# Altium schematic sheet RF19_Sensor_CAN_Module_MCU.SchDoc
size A4; Author: Tal Zaitsev; CompanyName: Ryerson Formula Racing; Engineer: Tal Zaitsev; DocumentNumber: 1; Revision: 00A; SheetNumber: 1; SheetTotal: 3
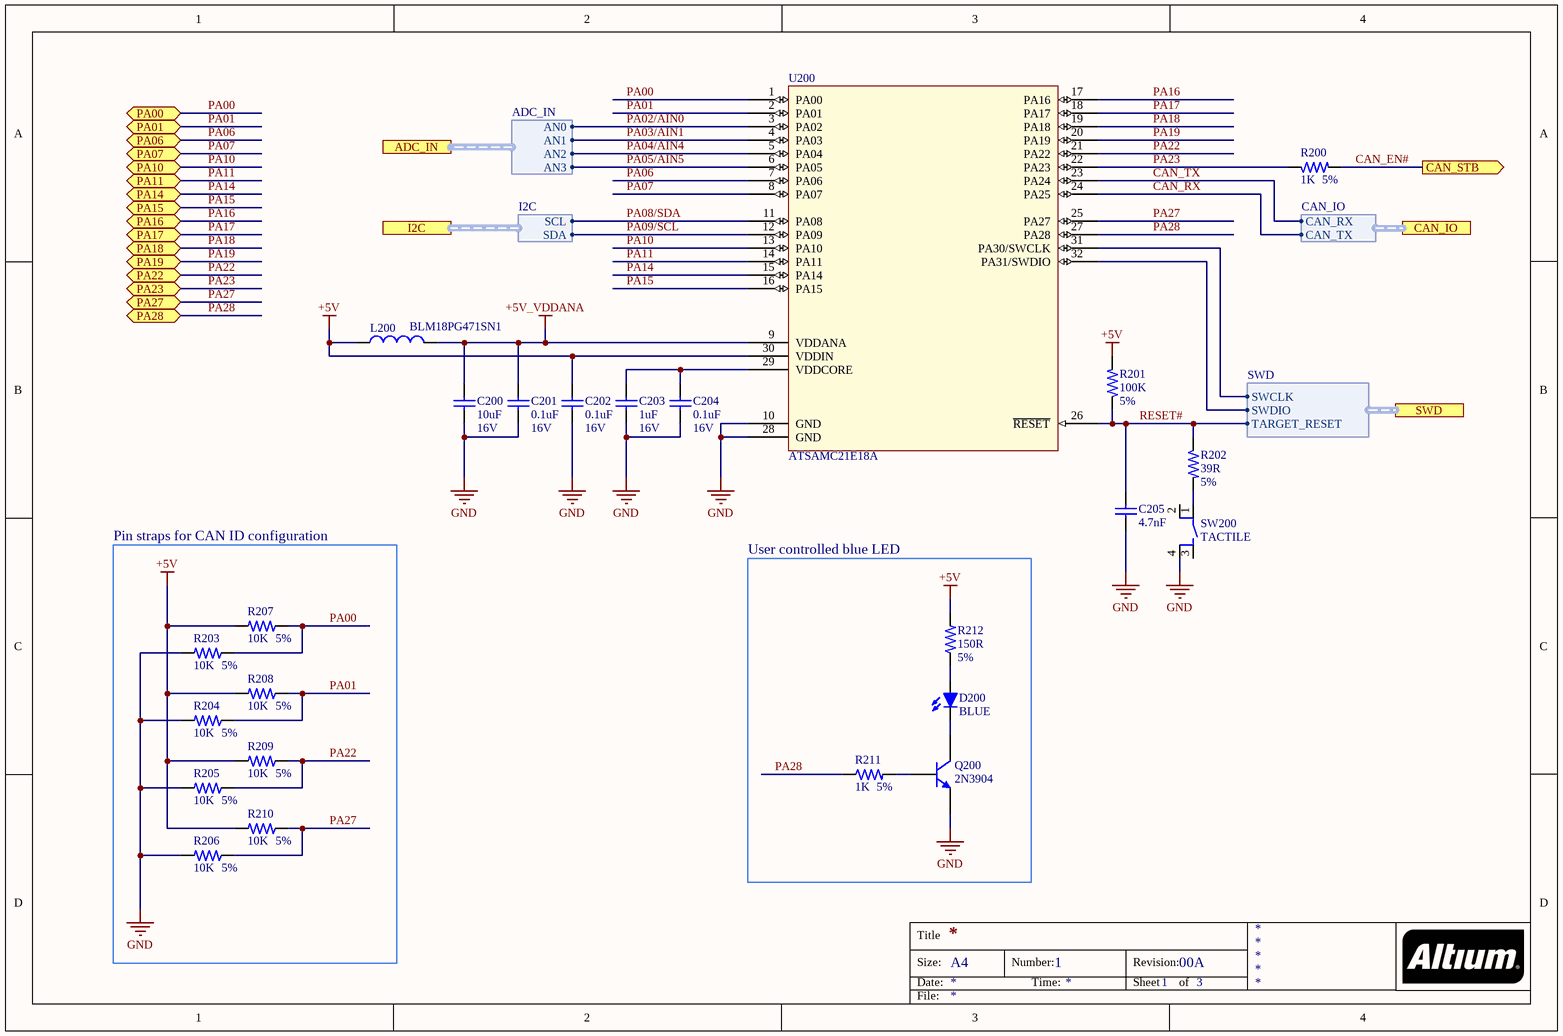
[diagram p0: RF19_Sensor_CAN_Module_MCU.SchDoc]

## Parts
C200  value 10uF  Voltage: 16V  [C0603]  (hidden comment: CERAMIC CAP)
C201  value 0.1uF  Voltage: 16V  [C0402]  (hidden comment: CERAMIC CAP)
C202  value 0.1uF  Voltage: 16V  [C0402]  (hidden comment: CERAMIC CAP)
C203  value 1uF  Voltage: 16V  [C0402]  (hidden comment: CERAMIC CAP)
C204  value 0.1uF  Voltage: 16V  [C0402]  (hidden comment: CERAMIC CAP)
C205  value 4.7nF  [C0402]  (hidden comment: CAP CERAMIC)
D200  BLUE  [0603 LED]
L200  value BLM18PG471SN1  [L0603_MURATA]
Q200  2N3904  [SOT323-3L]
R200  value 1K  Tolerance: 5%  [R0402]  (hidden comment: R001K50P0402063)
R201  value 100K  Tolerance: 5%  [R0402]  (hidden comment: R100K50P0402063)
R202  value 39R  Tolerance: 5%  [R0402]  (hidden comment: R039R50P0402063)
R203  value 10K  Tolerance: 5%  [R0402]  (hidden comment: R010K50P0402063)
R204  value 10K  Tolerance: 5%  [R0402]  (hidden comment: R010K50P0402063)
R205  value 10K  Tolerance: 5%  [R0402]  (hidden comment: R010K50P0402063)
R206  value 10K  Tolerance: 5%  [R0402]  (hidden comment: R010K50P0402063)
R207  value 10K  Tolerance: 5%  [R0402]  (hidden comment: R010K50P0402063)
R208  value 10K  Tolerance: 5%  [R0402]  (hidden comment: R010K50P0402063)
R209  value 10K  Tolerance: 5%  [R0402]  (hidden comment: R010K50P0402063)
R210  value 10K  Tolerance: 5%  [R0402]  (hidden comment: R010K50P0402063)
R211  value 1K  Tolerance: 5%  [R0402]  (hidden comment: R001K50P0402063)
R212  value 150R  Tolerance: 5%  [R0402]  (hidden comment: R150R50P0402063)
SW200  TACTILE  [TACTILE GULL WING KMR7]
U200  ATSAMC21E18A  [ATMEL_TQFP-32]

## Blocks framed on the sheet
Pin straps for CAN ID configuration: R203-R210
User controlled blue LED: D200 Q200 R211 R212

## Ports
ADC_IN (harness ADC_IN), CAN_IO (harness CAN_IO), CAN_STB (out), I2C (harness I2C), PA00 (bidir), PA01 (bidir), PA06 (bidir), PA07 (bidir), PA10 (bidir), PA11 (bidir), PA14 (bidir), PA15 (bidir), PA16 (bidir), PA17 (bidir), PA18 (bidir), PA19 (bidir), PA22 (bidir), PA23 (bidir), PA27 (bidir), PA28 (bidir), SWD (harness SWD)

## Harnesses
SWD: SWCLK, SWDIO, TARGET_RESET
CAN_IO: CAN_RX, CAN_TX
ADC_IN: AN0, AN1, AN2, AN3
I2C: SCL, SDA

## Nets
+5V: C202.1 L200.1 R201.2 R207.2 R208.2 R209.2 R210.2 R212.2 U200.30(VDDIN)
+5V_VDDANA: C200.1 C201.1 L200.2 U200.9(VDDANA)
GND: C200.2 C201.2 C202.2 C203.2 C204.2 C205.2 Q200.3(E) R203.2 R204.2 R205.2 R206.2 SW200.4 U200.10(GND) U200.28(GND)
CAN_EN#: R200.2 ; port CAN_STB
CAN_RX: U200.24(PA25) ; port CAN_IO.CAN_TX
CAN_TX: U200.23(PA24) ; port CAN_IO.CAN_RX
PA00: R203.1 R207.1 U200.1(PA00) ; port PA00
PA01: R204.1 R208.1 U200.2(PA01) ; port PA01
PA02/AIN0: U200.3(PA02) ; port ADC_IN.AN0
PA03/AIN1: U200.4(PA03) ; port ADC_IN.AN1
PA04/AIN4: U200.5(PA04) ; port ADC_IN.AN2
PA05/AIN5: U200.6(PA05) ; port ADC_IN.AN3
PA06: U200.7(PA06) ; port PA06
PA07: U200.8(PA07) ; port PA07
PA08/SDA: U200.11(PA08) ; port I2C.SCL
PA09/SCL: U200.12(PA09) ; port I2C.SDA
PA10: U200.13(PA10) ; port PA10
PA11: U200.14(PA11) ; port PA11
PA14: U200.15(PA14) ; port PA14
PA15: U200.16(PA15) ; port PA15
PA16: U200.17(PA16) ; port PA16
PA17: U200.18(PA17) ; port PA17
PA18: U200.19(PA18) ; port PA18
PA19: U200.20(PA19) ; port PA19
PA22: R205.1 R209.1 U200.21(PA22) ; port PA22
PA23: R200.1 U200.22(PA23) ; port PA23
PA27: R206.1 R210.1 U200.25(PA27) ; port PA27
PA28: R211.1 U200.27(PA28) ; port PA28
RESET#: C205.1 R201.1 R202.1 U200.26(~{RESET}) ; port SWD.TARGET_RESET
NetC203_1: C203.1 C204.1 U200.29(VDDCORE)
NetD200_A: D200.A R212.1
NetD200_C: D200.C Q200.1(C)
NetQ200_2: Q200.2(B) R211.2
NetR202_2: R202.2 SW200.1
NetU200_31: U200.31(PA30/SWCLK) ; port SWD.SWCLK
NetU200_32: U200.32(PA31/SWDIO) ; port SWD.SWDIO

Not connected (* = marked no-connect by the designer): SW200 2 3

## Notes on the sheet
- Title
- Size:
- Date:
- A4
- Number:
- Time:
- Revision:
- Sheet
- of
- File:

## Library data of the parts
C200 = C010U10P16VX5R0603: Ceramic cap, 10uF +/-10% 16V X5R 0603; Supplier 1: Mouser; Supplier 2: Digi-Key; Supplier Part Number 1: 81-GRM188R61C106KALD; Supplier Part Number 2: 490-10728-1-ND
C201 C202 C204 = C00U110P16VX5R0402: Ceramic cap, 0.1uF +/-10% 16V X5R 0402; Supplier 1: Mouser; Supplier Part Number 1: 581-0402YD104K; Supplier 2: Digi-Key; Supplier Part Number 2: 478-1126-1-ND
C203 = C001U10P16VX5R0402: Ceramic cap, 1uF +/-10% 16V X5R 0402; Supplier 1: Mouser; Supplier 2: Digi-Key; Supplier Part Number 1: 963-EMK105BJ105KV-F; Supplier Part Number 2: 1276-1067-1-ND
C205 = CAP CERAMIC: Ceramic capacitor
D200 = D0603BLUE: LED Blue, 0603 3.3V 20mA; Supplier 1: Mouser; Supplier Part Number 1: 859-LTST-C191TBKT; ComponentLink1Description: Datasheet; ComponentLink1URL: http://optoelectronics.liteon.com/upload/download/DS22-2000-230/LTST-C191TBKT.pdf; Supplier 2: Digi-Key; Supplier Part Number 2: 160-1647-6-ND
L200 = A03-0035: SMD RF inductor 0603. Z=470Ohm (@100MHz), Max R(dc)=0.65Ohm, Max current=1A; PartGroup: Inductors,EMI; Manufacturer: Murata; Tolerance: ±25%; TemperatureRange: -55°C to +125°C; AN: A03-0035; Height: 0,800000011920929; MPN: BLM18PG471SN1; Supplier 1: Digi-Key; Supplier Part Number 1: 490-5223-1-ND; Supplier 2: Mouser; Supplier Part Number 2: 81-BLM18PG471SN1D
Q200 = QNPN: NPN Bipolar Transistor; Published: 8-Jun-2000; LatestRevisionDate: 29-May-2009; LatestRevisionNote: IPC-7351 Footprint Added.; PackageVersion: Aug-1999; PackageReference: SOT-23B; Publisher: Altium Limited; PackageDescription: 3-Pin SOT-23 Package 0.95 mm Pitch, 2.4 mm Lead Span; Supplier 1: Digi-Key; Supplier Part Number 1: MMBT3904WT1GOSDKR-ND; Supplier 2: Mouser; Supplier Part Number 2: 863-MMBT3904WT1G
R200 R211 = R001K50P0402063: Resistor 1K 5% 0402 1/16W; Supplier 1: Mouser; Supplier Part Number 1: 603-RC0402JR-071KL; ComponentLink1Description: Datasheet; ComponentLink1URL: http://www.yageo.com/documents/recent/PYu-RC_Group_51_RoHS_L_9.pdf; Supplier 2: Digi-Key; Supplier Part Number 2: 311-1.0KJRDKR-ND
R201 = R100K50P0402063: Resistor 100K 5% 0402 1/16W; Supplier 1: Mouser; Supplier Part Number 1: 603-RC0402JR-07100KL; ComponentLink1Description: Datasheet; ComponentLink1URL: http://www.yageo.com/documents/recent/PYu-RC_Group_51_RoHS_L_9.pdf; Supplier Part Number 2: 311-100KJRDKR-ND; Supplier 2: Digi-Key
R202 = R039R50P0402063: Resistor 39R 5% 0402 1/16W; Supplier 1: Mouser; Supplier Part Number 1: 603-RC0402JR-0739RL; Supplier 2: Digi-Key; Supplier Part Number 2: 311-39JRCT-ND; ComponentLink1Description: Datasheet; ComponentLink1URL: http://www.yageo.com/documents/recent/PYu-RC_Group_51_RoHS_L_9.pdf
R203-R210 = R010K50P0402063: Resistor 10K 5% 0402 1/16W; Supplier 1: Digi-Key; Supplier Part Number 1: 311-10KJRDKR-ND; ComponentLink1Description: Datasheet; ComponentLink1URL: http://www.yageo.com/documents/recent/PYu-RC_Group_51_RoHS_L_9.pdf; Supplier 2: Mouser; Supplier Part Number 2: 603-RC0402JR-0710KL
R212 = R150R50P0402063: Resistor 150R 5% 0402 1/16W; Supplier 1: Mouser; Supplier Part Number 1: 603-RC0402JR-07150RL; ComponentLink1Description: Datasheet; ComponentLink1URL: http://www.yageo.com/documents/recent/PYu-RC_Group_51_RoHS_L_9.pdf; Supplier 2: Digi-Key; Supplier Part Number 2: 311-150JRDKR-ND
SW200 = SWITCH TACTILE ALT: Tactile Switch SPST-NO Top Actuated Surface Mount; Supplier 1: Mouser; Supplier Part Number 1: 611-PTS810SJS250SMTR; ComponentLink1Description: Datasheet; ComponentLink1URL: https://www.ckswitches.com/media/1476/pts810.pdf; Supplier 2: Digi-Key; Supplier Part Number 2: CKN10878CT-ND
U200 = ATSAMC21E18A: Atmel SAM ARM Cortex-M0+ 32-bit MCU